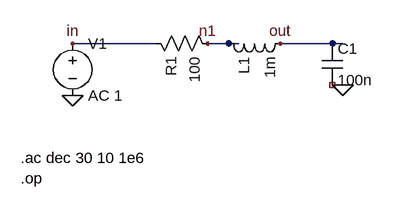
[diagram p0: schematic rlc_series_lowpass_ac.asc]
rlc_series_lowpass_ac.asc, the LTspice schematic file:
Version 4
SHEET 1 1400 900
WIRE 128 176 256 176
WIRE 336 176 384 176
WIRE 448 176 544 176
FLAG 128 176 in
FLAG 336 176 n1
FLAG 448 176 out
FLAG 128 256 0
FLAG 544 240 0
SYMBOL voltage 128 160 R0
SYMATTR InstName V1
SYMATTR Value AC 1
SYMBOL res 240 160 M90
SYMATTR InstName R1
SYMATTR Value 100
SYMBOL ind 352 160 M90
SYMATTR InstName L1
SYMATTR Value 1m
SYMBOL cap 512 176 R0
SYMATTR InstName C1
SYMATTR Value 100n
TEXT 48 352 Left 2 !.ac dec 30 10 1e6
TEXT 48 384 Left 2 !.op

The netlist it stands for:
* rlc_series_lowpass_ac.asc
V1 in 0 AC 1
R1 in n1 100
L1 n1 out 1m
C1 out NC_01 100n
.ac dec 30 10 1e6
.op
.backanno
.end